# EAGLE design midi_to_cv (EAGLE 7.1.0)
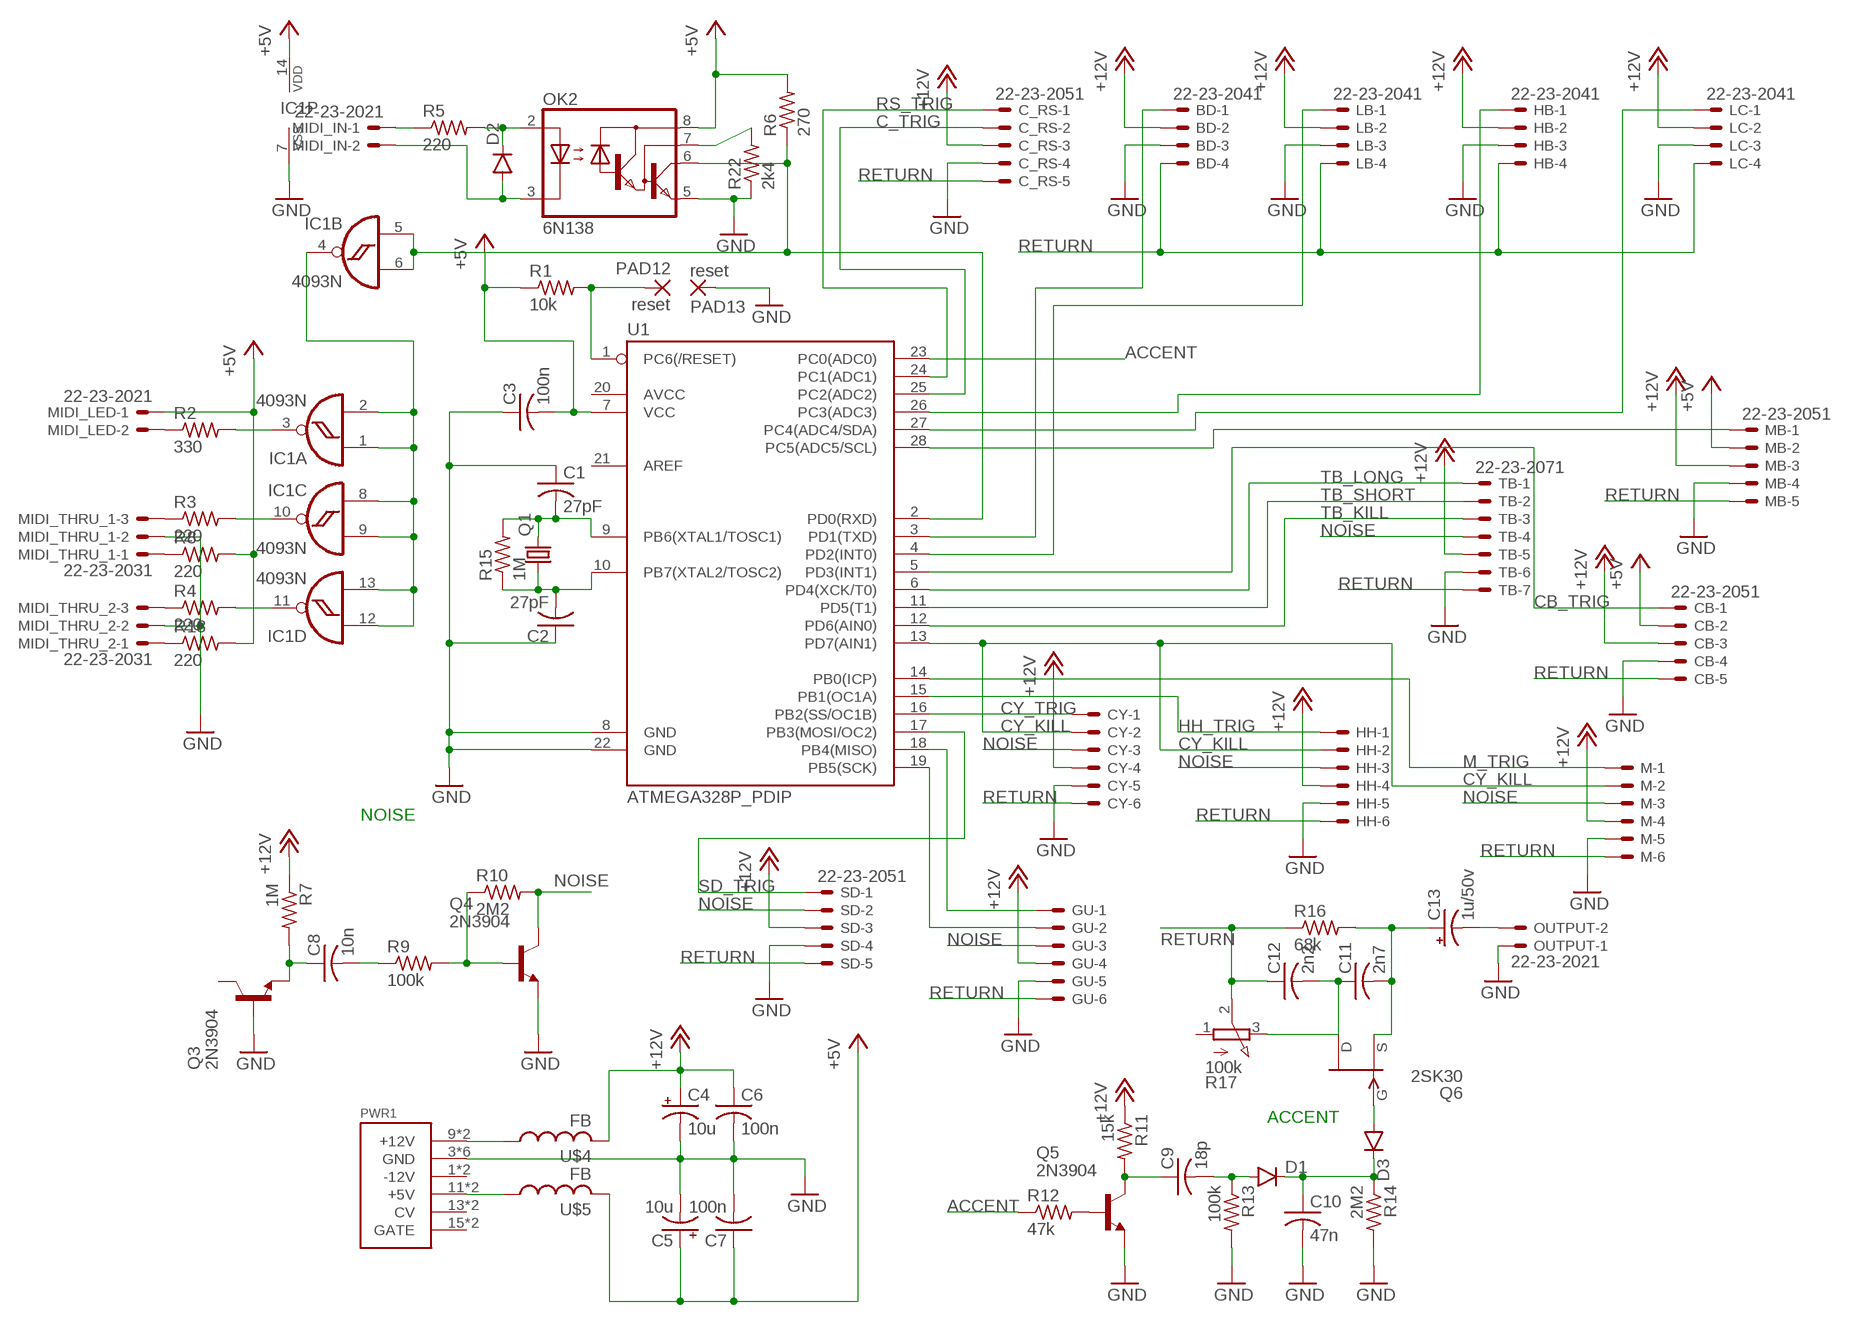
[diagram p0: schematic, sheet 1]

## Parts
BD  22-23-2041  [22-23-2041]
C1  27pF  C-US025-040X050  [C025-040X050]
C2  27pF  C-US025-040X050  [C025-040X050]
C3  100n  C-US025-040X050  [C025-040X050]
C4  10u  CPOL-USB45181A  [B45181A]
C5  10u  CPOL-USB45181A  [B45181A]
C6  100n  C-US050-024X044  [C050-024X044]
C7  100n  C-US050-024X044  [C050-024X044]
C8  10n  C-US025-040X050  [C025-040X050]
C9  18p  C-US050-025X075  [C050-025X075]
C10  47n  C-US025-040X050  [C025-040X050]
C11  2n7  C-US025-040X050  [C025-040X050]
C12  2n2  C-US025-040X050  [C025-040X050]
C13  1u/50v  CPOL-USB45181A  [B45181A]
C_RS  22-23-2051  [22-23-2051]
CB  22-23-2051  [22-23-2051]
CY  22-23-2061  [22-23-2061]
D1  DIODEKIT  [DIODE-1N4148-KIT]
D2  DIODE1N4148  [DIODE-1N4148]
D3  DIODE1N4148  [DIODE-1N4148]
GU  22-23-2061  [22-23-2061]
HB  22-23-2041  [22-23-2041]
HH  22-23-2061  [22-23-2061]
IC1  4093N  [DIL14]
LB  22-23-2041  [22-23-2041]
LC  22-23-2041  [22-23-2041]
M  22-23-2061  [22-23-2061]
MB  22-23-2051  [22-23-2051]
MIDI_IN  22-23-2021  [22-23-2021]
MIDI_LED  22-23-2021  [22-23-2021]
MIDI_THRU_1  22-23-2031  [22-23-2031]
MIDI_THRU_2  22-23-2031  [22-23-2031]
OK2  6N138  [DIL08]
OUTPUT  22-23-2021  [22-23-2021]
PAD12  reset  2,54/0,9  [2,54/0,9]
PAD13  reset  2,54/0,9  [2,54/0,9]
PWR1  POWER  [POWER_16]
Q1  CRYSTALHC49U-V  [HC49U-V]
Q3  2N3904  [TO92]
Q4  2N3904  [TO92]
Q5  2N3904  [TO92]
Q6  2SK30  [TO92]
R1  10k  R-US_0204/7  [0204/7]
R2  330  R-US_0204/7  [0204/7]
R3  220  R-US_0204/7  [0204/7]
R4  220  R-US_0204/7  [0204/7]
R5  220  R-US_0204/7  [0204/7]
R6  270  R-US_0204/7  [0204/7]
R7  1M  R-US_0204/7  [0204/7]
R8  220  R-US_0204/7  [0204/7]
R9  100k  R-US_0204/7  [0204/7]
R10  2M2  R-US_0204/7  [0204/7]
R11  15k  R-US_0204/7  [0204/7]
R12  47k  R-US_0207/12  [0207/12]
R13  100k  R-US_0204/7  [0204/7]
R14  2M2  R-US_0204/7  [0204/7]
R15  1M  R-US_0204/7  [0204/7]
R16  68k  R-US_0204/7  [0204/7]
R17  100k  3RP/1610N  [3RP/1610N]
R18  220  R-US_0204/7  [0204/7]
R22  2k4  R-US_0204/7  [0204/7]
SD  22-23-2051  [22-23-2051]
TB  22-23-2071  [22-23-2071]
U1  ATMEGA328P_PDIP  [DIL28-3]
U$4  FB  [FB]
U$5  FB  [FB]

## Nets
+5V: C3.2 C5.+ C7.1 CB.2 IC1.14(P:VDD) MB.2 MIDI_LED.1 OK2.8(VCC) R1.1 R6.2 R8.2 R18.2 U1.7(VCC) U$5.P$2
+12V: BD.2 C4.+ C6.1 C_RS.3 CB.3 CY.4 GU.4 HB.2 HH.4 LB.2 LC.2 M.4 MB.3 R7.1 R11.1 SD.3 TB.5 U$4.P$2
ACCENT: R12.1 U1.23(PC0(ADC0))
C_TRIG [GND]: C_RS.2 U1.25(PC2(ADC2))
CB_TRIG: CB.1 U1.5(PD3(INT1))
CY_KILL: CY.2 HH.2 M.2 U1.13(PD7(AIN1))
CY_TRIG: CY.1 U1.16(PB2(SS/OC1B))
GND: BD.3 C1.1 C2.1 C3.1 C4.- C5.- C6.2 C7.2 C10.2 C_RS.4 CB.4 CY.5 GU.5 HB.3 HH.5 IC1.7(P:VSS) LB.3 LC.3 M.5 MB.4 MIDI_THRU_1.2 MIDI_THRU_2.2 OK2.5(GND) OUTPUT.1 PAD13.1(P) PWR1.3(GND) PWR1.4(GND) PWR1.5(GND) PWR1.6(GND) PWR1.7(GND) PWR1.8(GND) Q3.2(B) Q4.3(E) Q5.3(E) R13.2 R14.2 R22.1 SD.4 TB.6 U1.8(GND) U1.22(GND)
HH_TRIG: HH.1 U1.15(PB1(OC1A))
M_TRIG: M.1 U1.14(PB0(ICP))
N$1: PAD12.1(P) R1.2 U1.1(PC6(/RESET))
N$2: PWR1.9(+12V) PWR1.10(+12V) U$4.P$1
N$3: BD.1 U1.3(PD1(TXD))
N$4: C1.2 Q1.2 R15.2 U1.9(PB6(XTAL1/TOSC1))
N$5: C2.2 Q1.1 R15.1 U1.10(PB7(XTAL2/TOSC2))
N$6: C8.1 Q3.3(E) R7.2
N$7: LB.1 U1.4(PD2(INT0))
N$8: C8.2 R9.1
N$9: GU.1 U1.18(PB4(MISO))
N$10: GU.2 U1.19(PB5(SCK))
N$11: IC1.5(B:I0) IC1.6(B:I1) OK2.6(VO) R6.1 U1.2(PD0(RXD))
N$12: IC1.3(A:O) R2.2
N$13: Q4.2(B) R9.2 R10.1
N$14: HB.1 U1.26(PC3(ADC3))
N$15: C9.1 Q5.1(C) R11.2
N$16: Q5.2(B) R12.2
N$17: D2.A MIDI_IN.2 OK2.3(C)
N$18: D2.C OK2.2(A) R5.2
N$19: MIDI_IN.1 R5.1
N$20: MIDI_THRU_1.1 R8.1
N$21: C9.2 D1.A R13.1
N$22: C10.1 D1.C D3.C R14.1
N$23: D3.A Q6.2(G)
N$24: MB.1 U1.28(PC5(ADC5/SCL))
N$25: LC.1 U1.27(PC4(ADC4/SDA))
N$26: C13.- OUTPUT.2
N$27: IC1.10(C:O) R3.2
N$28: IC1.11(D:O) R4.2
N$29: C11.1 C12.2 Q6.1(D) R17.3(E)
N$30: IC1.1(A:I0) IC1.2(A:I1) IC1.4(B:O) IC1.8(C:I0) IC1.9(C:I1) IC1.12(D:I0) IC1.13(D:I1)
N$31: MIDI_LED.2 R2.1
N$32: C11.2 C13.+ Q6.3(S) R16.2
N$33: MIDI_THRU_1.3 R3.1
N$34: MIDI_THRU_2.3 R4.1
N$35: MIDI_THRU_2.1 R18.1
N$60: OK2.7(VB) R22.2
N$62: PWR1.11(+5V) PWR1.12(+5V) U$5.P$1
NOISE [GND]: CY.3 GU.3 HH.3 M.3 Q4.1(C) R10.2 SD.2 TB.4
RETURN: BD.4 C12.1 C_RS.5 CB.5 CY.6 GU.6 HB.4 HH.6 LB.4 LC.4 M.6 MB.5 R16.1 R17.2(S) SD.5 TB.7
RS_TRIG: C_RS.1 U1.24(PC1(ADC1))
SD_TRIG: SD.1 U1.17(PB3(MOSI/OC2))
TB_KILL: TB.3 U1.12(PD6(AIN0))
TB_LONG: TB.1 U1.6(PD4(XCK/T0))
TB_SHORT: TB.2 U1.11(PD5(T1))
Unconnected: PWR1.1(-12V) PWR1.2(-12V) PWR1.13(CV) PWR1.14(CV) PWR1.15(GATE) PWR1.16(GATE) Q3.1(C) R17.1(A) U1.20(AVCC) U1.21(AREF)

## Notes on the sheet
- NOISE
- ACCENT

## Library data of the parts
BD HB LB LC = con-molex:22-23-2041: .100" (2.54mm) Center Header - 4 Pin; MF: MOLEX; MPN: 22-23-2041; OC_FARNELL: 1462920; OC_NEWARK: 38C0355
C1-C3 C6-C12 = rcl:C-US: CAPACITOR, American symbol
C4 C5 C13 = rcl:CPOL-US: POLARIZED CAPACITOR, American symbol
C_RS CB MB SD = con-molex:22-23-2051: .100" (2.54mm) Center Header - 5 Pin; MF: MOLEX; MPN: 22-23-2051; OC_FARNELL: 1462952; OC_NEWARK: 38C9178
CY GU HH M = con-molex:22-23-2061: .100" (2.54mm) Center Header - 6 Pin; MF: MOLEX; MPN: 22-23-2061; OC_FARNELL: 1462922; OC_NEWARK: 27C1933
D1-D3 = SparkFun-DiscreteSemi:DIODE: Diode These are standard reverse protection diodes and small signal diodes. SMA package can handle up to about 1A. SOD-323 can handle about 200mA. What the SOD-323 package when ordering, there are some mfgs out there that are 5-pin packages.
IC1 = 40xx:4093: Quad 2-input NAND schmitt trigger
MIDI_IN MIDI_LED OUTPUT = con-molex:22-23-2021: .100" (2.54mm) Center Header - 2 Pin; MF: MOLEX; MPN: 22-23-2021; OC_FARNELL: 1462926; OC_NEWARK: 25C3832
MIDI_THRU_1 MIDI_THRU_2 = con-molex:22-23-2031: .100" (2.54mm) Center Header - 3 Pin; MF: MOLEX; MPN: 22-23-2031; OC_FARNELL: 1462950; OC_NEWARK: 30C0862
OK2 = optocoupler:6N138: MOTOROLA OPTO COUPLER; MF: VISHAY/TELEFUNKEN; MPN: 6N138; OC_FARNELL: 9860150; OC_NEWARK: 35K5294
PAD12 PAD13 = wirepad:2,54/0,9: THROUGH-HOLE PAD
PWR1 = eurorack:POWER
Q1 = crystal:CRYSTAL: CRYSTAL; OC_FARNELL: 1666969; OC_NEWARK: unknown
Q3-Q5 = 808_lt:2N3904: NPN Transistor
Q6 = 808:2SK30
R1-R16 R18 R22 = rcl:R-US_: RESISTOR, American symbol
R17 = pot:3RP/1610N: 16mm Potentiometer one level Source: http://www.alphapotentiometers.net/html/16mm_pot_2.html
TB = con-molex:22-23-2071: .100" (2.54mm) Center Header - 7 Pin; MF: MOLEX; MPN: 22-23-2071; OC_FARNELL: 1654534; OC_NEWARK: 56H0445
U1 = SparkFun-DigitalIC:ATMEGA328P_PDIP: uC used in the Arduino 32kb flash, 1k EEPROM, 2k SRAM This is the through-hole version of this chip.
U$4 U$5 = adafruit:FB: Ferrite bead Digikey #P9821BK-ND

## Net classes
0 default: width 0.635 mm, drill 0.254 mm, clearance 0.254 mm
1 GND: width 1.016 mm, drill 1.016 mm, clearance 0.508 mm

## Board
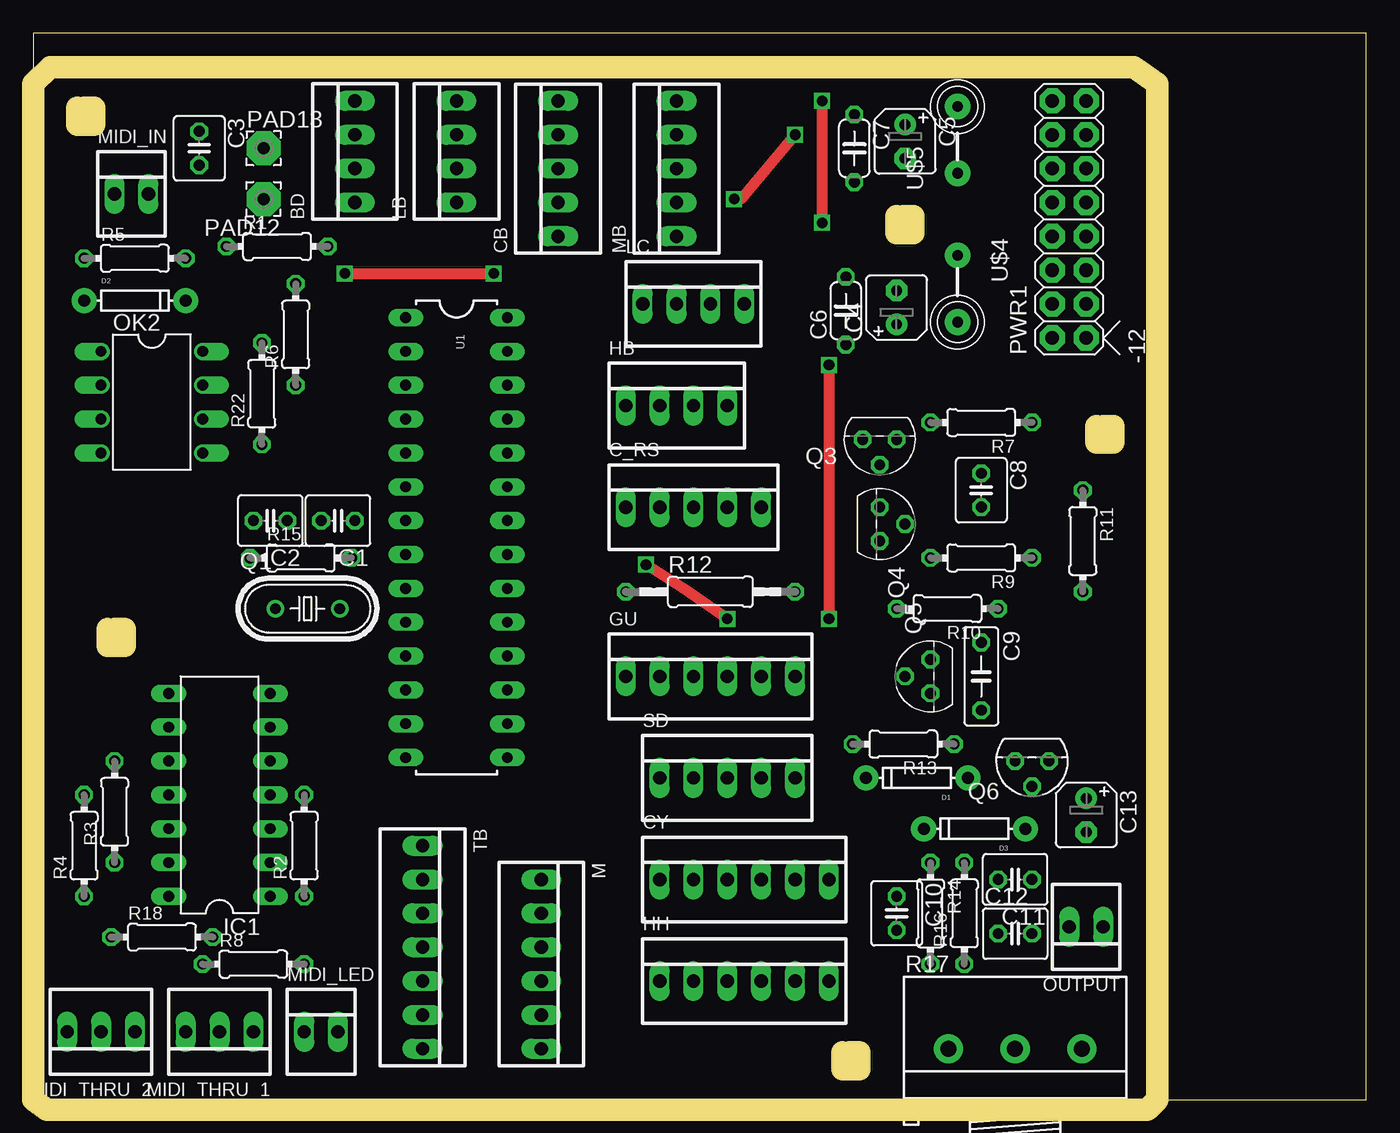
[diagram p1: board, top side]
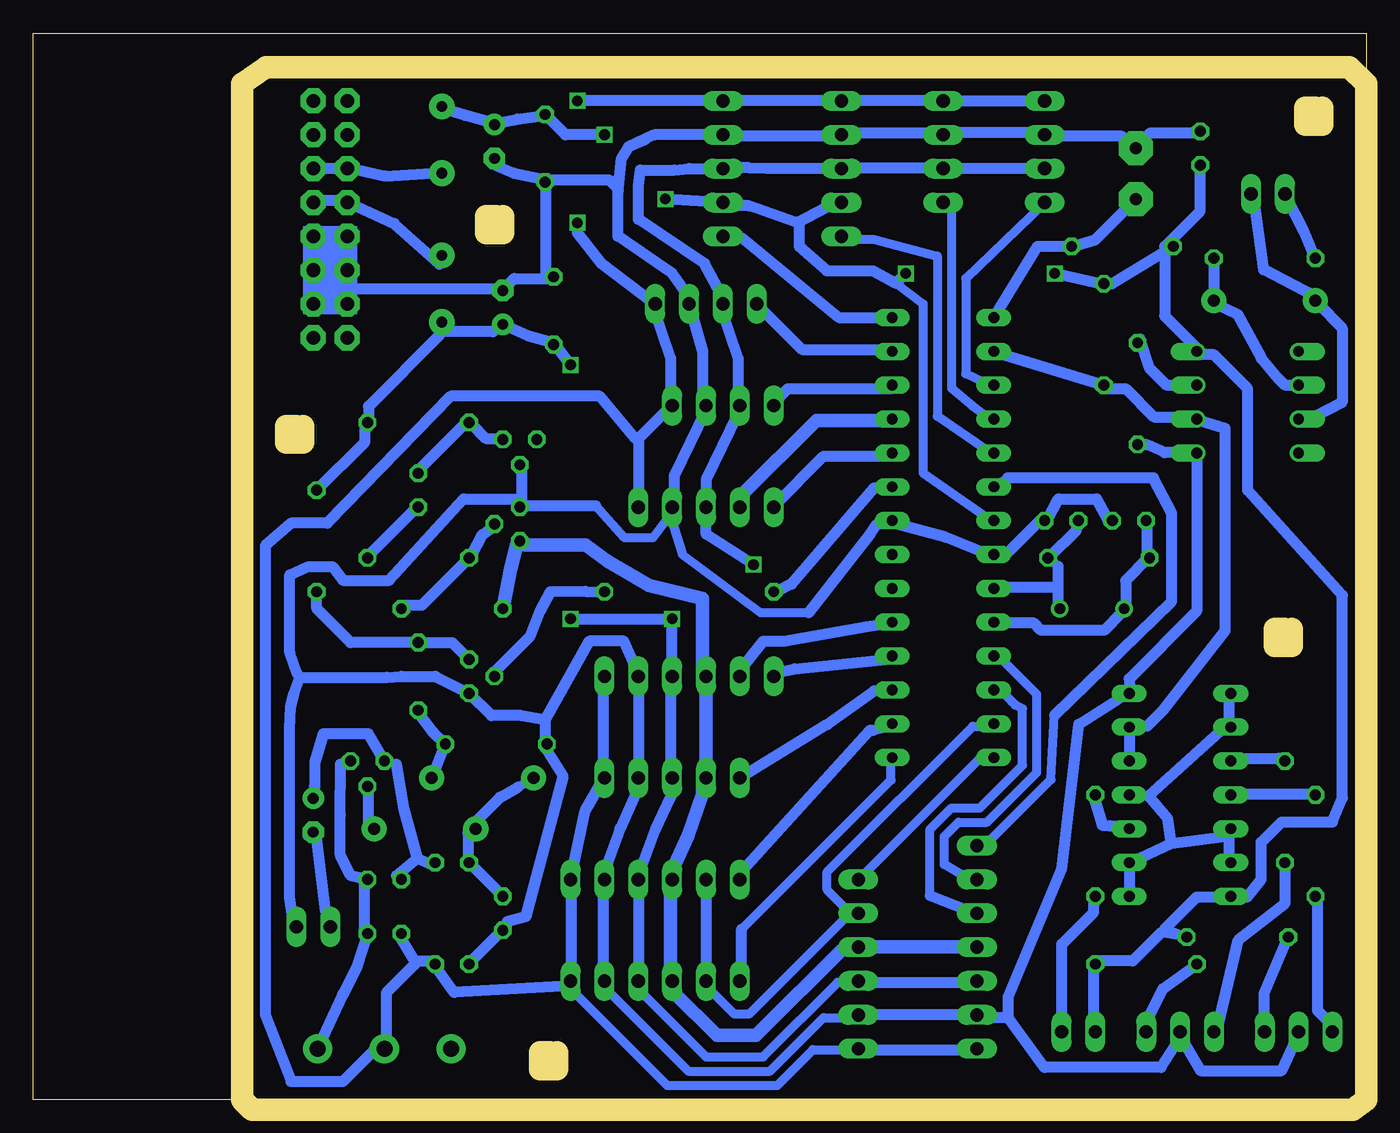
[diagram p2: board, bottom side, seen from below]

Size 100 x 80 mm. Coordinates in mm from the lower left corner, seen from the top.
Outline: 0,0 100,0 100,80 0,80 0,0
Copper layers (1*16): Top 0.035mm / dielectric 1.5mm / Bottom 0.035mm
Design rules "default *": minimum track width 26mil, minimum drill 31mil, track to track 16mil, track to pad 16mil, pad to pad 16mil, via to via 16mil, smd to smd 8mil, copper to edge 0mil, drill to drill 16mil, minimum pad ring 10mil, minimum via ring 8mil, stop-mask expansion 4mil, vias tented up to drill 0mil, thermal gap 10mil
Milling: 28 lines

### Footprints (pad centres in the part's own frame; a part is rotated, then mirrored left to right if it is on the bottom)
22-23-2041 = drill 1 long: 1 -3.81,0; 2 -1.27,0; 3 1.27,0; 4 3.81,0
C025-040X050 = drill 0.813 octagon: 1 -1.27,0; 2 1.27,0
B45181A = drill 0.813 pad 1.6: + -1.27,0 | drill 0.813 pad 1.6 octagon: - 1.27,0
C050-024X044 = drill 0.813 octagon: 1 -2.54,0; 2 2.54,0
C050-025X075 = drill 0.813 octagon: 1 -2.54,0; 2 2.54,0
22-23-2051 = drill 1 long: 1 -5.08,0; 2 -2.54,0; 3 0,0; 4 2.54,0; 5 5.08,0
22-23-2061 = drill 1 long: 1 -6.35,0; 2 -3.81,0; 3 -1.27,0; 4 1.27,0; 5 3.81,0; 6 6.35,0
DIODE-1N4148-KIT = drill 0.9 pad 1.88: A -3.81,0; C 3.81,0
DIODE-1N4148 = drill 0.9 pad 1.88: A -3.81,0; C 3.81,0
DIL14 = drill 0.813 long: 1 -7.62,-3.81; 2 -5.08,-3.81; 3 -2.54,-3.81; 4 0,-3.81; 5 2.54,-3.81; 6 5.08,-3.81; 7 7.62,-3.81; 8 7.62,3.81; 9 5.08,3.81; 10 2.54,3.81; 11 0,3.81; 12 -2.54,3.81; 13 -5.08,3.81; 14 -7.62,3.81
22-23-2021 = drill 1 long: 1 -1.27,0; 2 1.27,0
22-23-2031 = drill 1 long: 1 -2.54,0; 2 0,0; 3 2.54,0
DIL08 = drill 0.813 offset: 1 -3.81,-3.81; 2 -1.27,-3.81; 3 1.27,-3.81; 4 3.81,-3.81; 5 3.81,3.81; 6 1.27,3.81; 7 -1.27,3.81; 8 -3.81,3.81
2,54/0,9 = drill 0.914 pad 2.54 octagon: 1 0,0
POWER_16 = drill 1.016 pad 1.88 octagon: 1 -6.35,-1.27; 2 -6.35,1.27; 3 -3.81,-1.27; 4 -3.81,1.27; 5 -1.27,-1.27; 6 -1.27,1.27; 7 1.27,-1.27; 8 1.27,1.27; 9 3.81,-1.27; 10 3.81,1.27; 11 6.35,-1.27; 12 6.35,1.27; 13 8.89,-1.27; 14 8.89,1.27; 15 11.43,-1.27; 16 11.43,1.27
HC49U-V = drill 0.813: 1 -2.413,0; 2 2.413,0
TO92 = drill 0.813 octagon: 1 1.27,0; 2 0,1.905; 3 -1.27,0
TO92' = drill 0.813 octagon: 1 -1.27,0; 2 0,1.905; 3 1.27,0
0204/7 = drill 0.813 octagon: 1 -3.81,0; 2 3.81,0
0207/12 = drill 0.813 octagon: 1 -6.35,0; 2 6.35,0
3RP/1610N = drill 1.2 pad 2.184: 1 -5,0; 2 0,0; 3 5,0
22-23-2071 = drill 1 long: 1 -7.62,0; 2 -5.08,0; 3 -2.54,0; 4 0,0; 5 2.54,0; 6 5.08,0; 7 7.62,0
DIL28-3 = drill 0.813 long: 1 -16.51,-3.81; 2 -13.97,-3.81; 3 -11.43,-3.81; 4 -8.89,-3.81; 5 -6.35,-3.81; 6 -3.81,-3.81; 7 -1.27,-3.81; 8 1.27,-3.81; 9 3.81,-3.81; 10 6.35,-3.81; 11 8.89,-3.81; 12 11.43,-3.81; 13 13.97,-3.81; 14 16.51,-3.81; 15 16.51,3.81; 16 13.97,3.81; 17 11.43,3.81; 18 8.89,3.81; 19 6.35,3.81; 20 3.81,3.81; 21 1.27,3.81; 22 -1.27,3.81; 23 -3.81,3.81; 24 -6.35,3.81; 25 -8.89,3.81; 26 -11.43,3.81; 27 -13.97,3.81; 28 -16.51,3.81
FB = drill 0.8 pad 1.93: P$1 -2.5,0; P$2 2.5,0

### Placement (x,y rotation side)
BD  24.13,71.12 90 top
C1  22.86,43.43 180 top
C2  17.78,43.43 180 top
C3  12.45,71.37 270 top
C4  64.77,59.44 90 top
C5  65.41,71.88 270 top
C6  60.96,59.18 90 top
C7  61.59,71.37 270 top
C8  71.12,45.72 270 top
C9  71.12,31.75 270 top
C10  64.77,13.97 270 top
C11  73.66,16.51 180 top
C12  73.66,12.45 0 top
C13  78.99,21.34 270 top
C_RS  49.53,44.45 0 top
CB  39.37,69.85 90 top
CY  53.34,16.51 0 top
D1  66.29,24.13 180 top
D2  7.62,59.94 0 top
D3  70.61,20.32 180 top
GU  50.8,31.75 0 top
HB  48.26,52.07 0 top
HH  53.34,8.89 0 top
IC1  13.97,22.86 90 top
LB  31.75,71.12 90 top
LC  49.53,59.69 0 top
M  38.1,10.16 270 top
MB  48.26,69.85 90 top
MIDI_IN  7.37,67.94 0 top
MIDI_LED  21.59,5.08 0 top
MIDI_THRU_1  13.97,5.08 180 top
MIDI_THRU_2  5.08,5.08 180 top
OK2  8.89,52.32 270 top
OUTPUT  78.99,12.95 180 top
PAD12  17.27,67.56 180 top
PAD13  17.27,71.37 0 top
PWR1  77.72,63.5 90 top
Q1  20.57,36.83 0 top
Q3  63.5,49.53 180 top
Q4  63.5,43.18 270 top
Q5  67.31,31.75 90 top
Q6  2SK30  [TO92']  74.93,25.4 180 top
R1  18.29,64.01 0 top
R2  20.32,19.05 90 top
R3  6.1,21.59 90 top
R4  3.81,19.05 90 top
R5  7.62,63.12 0 top
R6  19.68,57.4 90 top
R7  71.12,50.8 180 top
R8  16.51,10.16 0 top
R9  71.12,40.64 180 top
R10  68.58,36.83 180 top
R11  78.74,41.91 270 top
R12  50.8,38.1 0 top
R13  65.28,26.67 180 top
R14  67.31,13.97 270 top
R15  20.07,40.64 0 top
R16  69.85,13.97 90 top
R17  73.66,3.81 0 top
R18  9.65,12.19 0 top
R22  17.14,52.96 90 top
SD  52.07,24.13 0 top
TB  29.21,11.43 270 top
U1  31.75,42.16 270 top
U$4  69.34,60.83 270 top
U$5  69.34,72.01 90 top

### Tracks (layer width: path | path; a pad name or v marks a point on that pad's centre or on a via)
+5V  (via drill 0.8)
  Top 0.813: v23.37,61.98 v34.54,61.98 | v52.58,67.56 53.09,67.56 v57.15,72.39
  Bottom 0.66: 12.71,56.39 12.71,56.27 OK2.8 | 15.11,63.74 R1.1 15.11,64.01 | 20.45,10.13 R8.2 20.18,10.4 | 20.45,5.33 MIDI_LED.1 | 12.71,15.2 10.31,15.2 IC1.14 | 15.11,12.8 R18.2 15.38,12.54 | 35.28,61.24 33.25,59.72 33.25,47.02 28.18,43.47 U1.7 | 39.92,67.21 39.38,67.21 CB.2 | 42.81,65.85 42.55,65.85 | 61.78,73.81 C7.1 | 65.25,73.25 C5.+ 65.52,73.25 | 69.25,74.35 U$5.P$2
  Bottom 0.813: 12.71,56.39 15.11,58.79 15.11,63.74 | C3.2 12.45,66.67 15.11,64.01 | 20.45,5.33 20.45,10.13 | 15.11,12.8 12.71,15.2 8.93,15.2 7.87,16.51 7.87,19.3 6.35,20.83 2.54,20.83 1.78,22.61 1.78,37.85 8.89,45.72 8.89,53.34 11.43,55.88 12.45,55.88 OK2.8 | 20.18,10.4 17.51,10.4 15.38,12.54 | 39.92,67.21 42.55,65.85 42.55,64.02 40.46,62.19 36.99,62.19 35.28,61.24 v34.54,61.98 | 42.81,65.85 46.32,67.07 48.02,67.07 MB.2 v52.58,67.56 | 61.78,73.81 63.68,73.56 65.25,73.25 | 69.25,74.35 67.63,73.84 65.52,73.25 | R1.1 19.05,61.21 R6.2 20.07,61.21 v23.37,61.98 | v57.15,72.39 60.07,72.39 C7.1
+12V  (via drill 0.8)
  Top 0.813: v52.07,36.07 48.77,38.35 v45.97,40.13 | v59.69,55.12 v59.69,36.07
  Bottom 0.66: 75.12,50.67 R7.1 74.85,50.94 | 60.98,56.81 C6.1 | 64.72,58.14 C4.+ 64.99,58.14 | 69.25,57.61 U$4.P$2 | 24.18,69.88 BD.2 | 31.65,69.88 LB.2 31.91,69.88 | 39.12,69.88 CB.3 39.65,69.88 | 47.12,52.27 HB.2 47.12,52.01 47.12,51.47 | 48.45,59.47 LC.2 48.18,60.01 | 49.52,44.54 C_RS.3 | 29.25,8.8 TB.5 | 38.05,8.8 M.4 38.32,8.8 39.65,8.8 45.25,3.2 49.52,3.2 54.32,8 54.32,8.8 HH.4 54.59,9.07 | 52.18,24.27 SD.3 52.18,24 52.18,22.67 | 52.18,31.74 GU.4 | 54.59,16.27 CY.4 54.59,16.8
  Bottom 0.813: 75.12,50.67 75.12,49.34 R11.1 | 64.72,58.14 62.88,57.31 60.98,56.81 v59.69,55.12 | 69.25,57.61 65.52,57.61 64.99,58.14 | 74.85,50.94 74.85,52.01 69.52,57.34 U$4.P$2 | 31.65,69.88 24.18,69.88 | 31.91,69.88 39.12,69.88 | 47.12,52.27 47.12,55.6 48.45,59.47 | 49.52,44.54 49.52,46.53 47.12,51.47 | 48.18,60.01 49.63,62.73 54.61,66.04 54.61,68.58 54.46,69.75 51.92,69.75 50.8,69.85 MB.3 48.2,69.91 46.29,69.91 44.98,69.88 39.65,69.88 | 38.05,8.8 29.25,8.8 | 52.18,31.74 52.18,24.27 | 54.59,16.27 54.59,9.07 | 52.18,22.67 53.31,20.27 54.59,16.8 | GU.4 v52.07,36.07 v59.69,36.07 | v45.97,40.13 49.53,42.42 C_RS.3
ACCENT
  Bottom 0.66: 44.13,38.14 R12.1 | 36.92,45.88 U1.23
  Bottom 0.813: 44.13,38.14 43.12,38.67 36.92,45.88
C_TRIG
  Bottom 1.016: U1.25 35.65,50.94 41.25,50.94 46.85,45.34 46.85,44.54 C_RS.2
CB_TRIG
  Bottom 0.66: U1.5 28.18,48.54 32.18,51.27 32.18,63.3 36.98,64.54 39.12,64.54 CB.1
CY_KILL
  Bottom 0.66: 49.52,9.07 HH.2 49.25,8.8 49.25,8.27 47.38,6.4 46.32,6.4 38.85,13.87 M.2 38.32,14.13 38.85,14.13 40.45,15.73 40.45,17.07 29.52,28 28.18,28 U1.13 | 49.52,16.27 CY.2
  Bottom 0.813: 49.52,16.27 49.52,9.07
CY_TRIG
  Bottom 0.66: 36.96,27.71 35.65,28 U1.16 | 46.85,17.07 46.85,16.54 CY.1
  Bottom 0.813: 36.96,27.71 37.22,27.71 46.85,17.07
GND
  Bottom 0.66: 79.12,62.41 PWR1.5 78.85,62.41 | 79.12,64.54 PWR1.7 | 76.45,60.81 PWR1.6 76.72,62.41 | 78.85,59.74 PWR1.3 | 76.72,59.74 PWR1.4 | 60.98,61.61 C6.2 | 64.72,60.81 C4.- 64.99,60.81 | 61.57,69.01 61.78,69.01 C7.2 61.52,69.01 | 65.25,70.08 C5.- | 12.71,48.27 OK2.5 12.98,48.54 | 31.91,72.54 LB.3 31.65,72.54 | 39.12,72.54 CB.4 39.65,72.28 | 12.45,72.54 C3.1 | 17.25,71.48 PAD13.1 17.51,71.48 18.31,72.28 | 23.91,72.28 BD.3 24.18,72.54 | 19.39,43.47 19.11,43.47 C2.1 | 23.91,43.47 C1.1 24.45,43.47 | 26.85,41.07 27.91,41.07 U1.8 28.18,40.8 | 35.38,43.2 U1.22 35.65,43.2 | 63.39,44.54 Q4.3 | 63.39,47.47 Q3.2 | 49.78,52.27 HB.3 49.52,51.74 | 51.92,44.54 C_RS.4 | 50.85,60.27 50.85,60.01 LC.3 | 57.78,44.54 55.64,42.14 53.54,42.14 51.92,44.27 C_RS.4 | 63.12,44.54 Q4.3 | 41.82,36.54 45.43,36.54 51.31,40.89 52.18,43.74 C_RS.4 | 29.25,6.4 TB.6 28.98,6.13 | 38.05,6.4 M.5 38.32,6.13 40.72,6.13 44.72,2.13 50.85,2.13 56.98,8.27 56.98,8.8 HH.5 57.25,9.07 | 5.25,4.53 5.25,5.07 MIDI_THRU_2.2 | 13.78,4.53 13.78,5.07 MIDI_THRU_1.2 14.05,4.53 | 80.5,13.37 OUTPUT.1 | 57.25,16.27 CY.5 57.25,16.8 | 64.99,12.54 C10.2 64.45,12.8 64.45,13.34 | 67.12,10.4 R14.2 | 54.85,32.54 54.85,32 GU.5 54.59,31.47 | 61.61,26.67 R13.2 61.61,26.4 | 54.59,24.27 SD.4 54.32,24 | 63.65,45.06 Q4.3 | 80.19,31.94 80.01,31.68 | 18.05,30.4 IC1.7
  Bottom 0.813: 79.12,64.54 79.12,62.41 | PWR1.4 76.45,60.81 64.99,60.81 | PWR1.6 PWR1.8 | 76.72,59.74 78.85,59.74 | 76.72,62.41 78.85,62.41 | 61.57,61.61 63.92,61.61 64.72,60.81 | 61.57,61.61 60.98,61.61 | 65.25,70.08 63.93,69.52 61.57,69.01 61.57,61.61 | IC1.7 17.78,31.57 12.71,36.64 12.71,48.27 | 12.98,48.54 15.11,48.54 16.47,49.14 R22.1 | 39.12,72.54 31.91,72.54 | 12.45,72.54 16.18,72.54 17.25,71.48 | 18.31,72.28 23.91,72.28 | 24.18,72.54 31.65,72.54 | 19.39,43.47 20.23,45.07 23.08,45.07 23.91,43.47 | 24.45,43.47 26.85,41.07 | 35.38,43.2 31.6,42.19 28.18,40.8 | 63.39,47.47 63.39,44.54 | 49.78,52.27 49.78,56.13 LC.3 | 51.92,44.54 51.92,46.8 49.52,51.74 | 50.85,60.27 52.05,61.98 56.13,64.77 56.13,68.07 | 57.78,44.54 63.12,44.54 | 35.65,43.2 36.7,43.17 37.22,42.41 41.82,36.54 | 38.05,6.4 29.25,6.4 | 5.25,4.53 6.35,2.16 12.42,2.16 13.78,4.53 | 26.85,6.13 28.98,6.13 | 26.85,6.13 24.14,2.41 15.4,2.41 14.05,4.53 | 80.5,13.37 80.77,15.16 80.77,27.84 80.7,29.44 80.44,30.49 80.01,31.68 73.47,31.68 72.39,31.75 69.85,31.75 Q5.3 65.63,28.8 63.39,28.8 61.61,28.54 | 57.25,16.27 57.25,9.07 | 67.12,10.4 64.99,12.54 | 61.61,28.54 61.61,26.67 | 61.61,28.54 58.29,34.39 55.69,34.39 54.85,32.54 | 54.59,31.47 54.59,24.27 | 64.45,13.34 63.06,13.72 60.26,24.3 61.61,26.4 | 57.25,16.8 55.98,20.31 54.32,24 | 63.65,45.06 67.7,45.06 73.3,38.95 76.77,38.95 77.56,39.99 79.38,39.99 80.76,39.37 80.76,33.53 80.19,31.94 | 18.05,30.4 21.57,28.16 22.84,17.32 26.85,7.72 26.85,6.13 | 56.13,68.07 56.13,68.33 56.82,69.01 61.52,69.01 | 56.13,68.07 55.85,70.64 55.35,71.49 | 55.35,71.49 54.1,72.02 | 39.65,72.28 48.15,72.28 MB.4 53.43,72.39 55.35,71.49
HH_TRIG
  Bottom 0.66: 46.85,12.78 35.65,23.98 35.65,25.6 U1.15 | 46.85,9.07 HH.1
  Bottom 0.813: 46.85,9.07 46.85,12.78
M_TRIG
  Bottom 0.66: U1.14 28.18,25.6 28.98,25.6 38.05,16.54 M.1
N$1
  Bottom 0.66: 22.57,63.99 22.23,63.74 R1.2 | 27.91,58.67 U1.1
  Bottom 0.813: 22.57,63.99 24.65,63.99 U1.1 | R1.2 20.32,64.52 PAD12.1
N$2
  Bottom 0.66: 76.45,67.47 PWR1.10 76.19,67.21 | 78.85,67.47 PWR1.9 | 69.52,62.67 U$4.P$1
  Bottom 0.813: 78.85,67.47 76.45,67.47 | 69.52,62.67 72.92,65.72 76.19,67.21
N$3
  Bottom 0.66: U1.3 28.18,53.61 30.05,54.46 30.05,61.59 24.18,67.21 BD.1
N$4
  Bottom 0.66: 23.11,40.01 23.65,40.54 R15.2 23.65,40.8 | 23.11,37.07 Q1.2 | 21.78,42.67 21.78,43.2 C1.2 | 27.91,38.41 U1.9
  Bottom 0.813: 23.11,40.01 23.11,38.41 | 23.11,38.41 23.11,37.07 | 23.65,40.8 21.78,42.67 | 23.11,38.41 27.91,38.41
N$5
  Bottom 0.66: 16.45,40.8 R15.1 16.45,40.54 | 16.45,43.2 C2.2 | 18.05,37.07 Q1.1 18.31,36.54 | 27.91,35.74 U1.10
  Bottom 0.813: 16.45,43.2 16.45,40.8 | 18.05,37.07 18.05,38.94 16.45,40.54 | 27.91,35.74 24.93,35.74 24.4,35.2 19.65,35.2 18.31,36.54
N$6
  Bottom 0.66: 71.12,47.21 C8.1 | 67.39,50.94 R7.2 67.12,50.67 | 64.99,49.61 Q3.3
  Bottom 0.813: 67.39,50.94 71.12,47.21 | 64.99,49.61 66.05,49.61 67.12,50.67
N$7
  Bottom 0.66: LB.1 31.11,66.67 31.11,53.37 29.52,52.02 28.49,51.26 28.18,51.21 U1.4
N$8
  Bottom 0.66: 74.85,40.8 R9.1 | 71.12,44.54 C8.2
  Bottom 0.813: 71.12,44.54 74.85,40.8
N$9
  Bottom 0.66: 35.65,33.07 U1.18 | 44.45,32 GU.1
  Bottom 0.813: 35.65,33.07 42.88,32.31 44.45,32
N$10
  Bottom 0.66: 35.65,35.74 U1.19 | 47.12,32 GU.2
  Bottom 0.813: 35.65,35.74 37.47,35.48 43.64,34.39 45.24,34.39 47.12,32
N$11
  Bottom 0.66: 12.71,51.21 OK2.6 12.45,50.94 | 19.65,53.34 R6.1 | 17.51,28 IC1.6
  Bottom 0.813: IC1.6 IC1.5 | 12.71,51.21 15.91,51.21 18.05,53.34 19.65,53.34 | 17.51,28 16.45,28 15.24,29.21 10.6,35.17 10.6,50.37 12.45,50.94 | U1.2 R6.1
N$12
  Bottom 0.66: 18.31,20.54 17.78,20.54 IC1.3 | 20.45,22.67 R2.2
  Bottom 0.813: 20.45,22.67 19.81,20.57 19.27,20.54 18.31,20.54
N$13
  Bottom 0.66: 72.19,37.07 R10.1 | 67.39,40.54 R9.2 67.12,40.8 | 65.52,42.94 Q4.2
  Bottom 0.813: 72.19,37.07 70.85,37.07 67.39,40.54 | 65.52,42.94 66.28,42.41 67.12,40.8
N$14
  Bottom 0.66: 35.65,53.34 U1.26 | 44.45,52.27 HB.1
  Bottom 0.813: 35.65,53.34 43.38,53.34 44.45,52.27
N$15
  Bottom 0.813: R11.2 78.74,36.83 76.2,34.29 C9.1 68.58,34.29 Q5.1
N$16
  Bottom 0.813: R12.2 58.59,38.12 61.21,38.1 62.01,36.61 62.78,34.7 65.41,32.07 Q5.2
N$17
  Bottom 0.66: 3.91,51.21 4.98,51.21 OK2.3 | 3.65,59.74 D2.A 3.91,60.27 | 8.45,67.74 MIDI_IN.2
  Bottom 0.813: 3.91,51.21 1.8,52.3 1.8,57.9 3.65,59.74 | 8.45,67.74 7.68,62.27 3.91,60.27
N$18
  Bottom 0.66: 5.25,53.61 OK2.2 | 11.38,59.74 D2.C 11.38,60.27 | 11.38,62.94 R5.2
  Bottom 0.813: 11.38,59.74 9.65,58.93 7.87,55.63 6.6,54.1 6.11,53.61 5.25,53.61 | 11.38,60.27 11.38,62.94
N$19
  Bottom 0.66: 3.91,63.21 R5.1 | 6.04,67.74 MIDI_IN.1
  Bottom 0.813: 3.91,63.21 4.67,65.1 6.04,67.74
N$20
  Bottom 0.66: 12.71,10.13 R8.1 | 16.71,5.33 MIDI_THRU_1.1
  Bottom 0.813: 12.71,10.13 15.25,8.32 16.71,5.33
N$21
  Bottom 0.66: 71.26,29.2 C9.2
  Bottom 0.813: 71.26,29.2 69.99,27.55 R13.1 D1.A
N$22
  Bottom 0.66: 64.99,15.47 C10.1 | 67.12,17.6 R14.1 67.39,17.87 | 63.65,23.43 D1.C | 67.12,20.54 D3.C 67.39,20
  Bottom 0.813: 67.12,17.6 64.99,15.47 | 63.65,23.43 64.99,22.67 67.12,20.54 | 67.39,20 67.39,17.87
N$23
  Bottom 0.66: 74.85,23.47 Q6.2 | 74.85,20.54 D3.A
  Bottom 0.813: 74.85,20.54 74.85,23.47
N$24
  Bottom 0.813: U1.28 39.59,58.67 46.85,64.67 MB.1
N$25
  Bottom 0.66: 35.65,56.27 U1.27 | 45.52,59.47 LC.1
  Bottom 0.813: 35.65,56.27 42.32,56.27 45.52,59.47
N$26
  Bottom 0.66: 79.41,19.81 78.85,20.27 | 78.09,14.13 OUTPUT.2
  Bottom 0.813: 78.85,20.27 78.09,14.13 | 79.41,19.81 C13.-
N$27
  Bottom 0.66: 6.58,25.6 R3.2 | 10.05,25.6 IC1.10
  Bottom 0.813: 10.05,25.6 6.58,25.6
N$28
  Bottom 0.66: 3.91,22.94 R4.2 | 10.05,22.94 IC1.11
  Bottom 0.813: 10.05,22.94 3.91,22.94
N$29
  Bottom 0.66: 75.17,12.8 C12.2 | 75.17,16.27 C11.1 | 76.45,25.34 Q6.1 | 78.59,4 R17.3
  Bottom 0.813: 75.17,16.27 75.17,12.8 | 76.45,25.34 76.96,25.15 76.97,21.32 76.97,18.35 76.19,16.8 C11.1 | 78.59,4 76.81,7.86 75.69,9.99 C12.2
N$30
  Bottom 0.66: 10.31,28 IC1.9 10.58,28 | 10.31,30.4 IC1.8 | 10.31,17.87 IC1.13 | 10.31,20.27 IC1.12 10.58,19.74 | 16.33,22.77 17.25,22.67 17.78,22.67 IC1.4 | 17.51,17.87 IC1.2
  Bottom 0.813: 10.31,30.4 10.31,28 | 10.31,20.27 10.31,17.87 | IC1.2 IC1.1 | 14.63,19.23 14.88,21.07 16.33,22.77 10.58,28 | 17.51,17.87 14.63,19.23 | 14.63,19.23 10.58,19.74
N$31
  Bottom 0.66: 20.45,15.2 R2.1 | 22.85,5.33 MIDI_LED.2
  Bottom 0.813: 20.45,15.2 20.45,14.05 22.85,11.65 22.85,5.33
N$32
  Bottom 0.66: 70.05,17.6 R16.2 | 72.76,25.15 73.52,25.34 Q6.3 73.79,25.6
  Bottom 0.813: 71.18,18.11 70.05,17.6 | 71.18,18.11 72.76,16.79 C11.2 | 72.76,25.15 72.2,21.79 71.18,18.11 | 73.79,25.6 74.87,27.45 78.25,27.45 78.88,25.29 78.91,23.51 C13.+
N$33
  Bottom 0.66: 11.11,5.6 11.38,5.33 MIDI_THRU_1.3 | 6.07,17.6 R3.1
  Bottom 0.813: 6.07,17.6 6.07,14.72 9.59,11.96 11.11,5.6
N$34
  Bottom 0.66: 3.65,15.2 R4.1 | 2.31,5.33 MIDI_THRU_2.3
  Bottom 0.813: 3.65,15.2 3.65,6.67 2.31,5.33
N$35
  Bottom 0.66: 7.64,5.33 MIDI_THRU_2.1
  Bottom 0.813: 7.64,5.33 7.64,7.96 R18.1
N$60
  Bottom 0.66: 16.98,57.07 16.98,56.35 R22.2 | 12.71,53.61 OK2.7
  Bottom 0.813: 16.98,57.07 16.26,54.86 15,53.61 12.71,53.61
N$62
  Bottom 0.66: 76.45,69.88 PWR1.12 76.19,69.88 | 78.85,69.88 PWR1.11 | 69.52,69.55 U$5.P$1
  Bottom 0.813: 78.85,69.88 76.45,69.88 | 69.52,69.55 73.57,69.29 76.19,69.88
NOISE
  Bottom 1.016: TB.4 29.25,11.47 38.05,11.47 M.3 38.58,11.47 39.12,11.47 45.78,4.8 48.72,4.8 51.92,8 51.92,8.53 HH.3 52.18,9.07 52.18,16.27 CY.3 51.91,17.56 50.89,19.8 49.78,22.94 49.78,23.74 SD.2 49.52,24.27 49.52,31.74 GU.3 49.78,32 49.78,37.59 53.8,38.56 54.81,39.17 56.9,40.39 58.59,41.6 63.12,41.6 Q4.1 63.65,41.87 64.21,39.79 64.72,37.07 R10.2
RETURN  (via drill 0.8)
  Top 0.813: v59.18,74.93 v59.18,65.79
  Bottom 0.66: 70.05,10.4 R16.1 69.79,9.87 69.76,9.87 | 72.5,12.28 C12.1 | 73.52,4 R17.2 73.79,3.73 74.4,3.73 | 71.39,10.13 71.39,10.4 | 29.25,3.73 TB.7 | 38.05,3.73 M.6 38.32,3.73 41.52,3.73 44.18,1.07 52.45,1.07 59.38,8 59.38,8.8 HH.6 | 59.65,9.07 HH.6 | 59.65,16.27 CY.6 59.65,16.8 | 57.25,24.27 SD.5 57.25,24 | 57.25,31.74 GU.6 | 59.65,8.53 HH.6 | 24.18,74.94 BD.4 | 31.65,74.94 LB.4 31.91,74.94 | 39.12,74.94 CB.5 39.65,74.94 | 52.18,52.27 HB.4 52.18,52.01 | 53.52,59.47 LC.4 53.25,60.01 | 54.59,44.54 C_RS.5 | 54.85,49.61 54.59,49.61 | 80.66,43.24 80.66,43.26
  Bottom 0.813: 70.05,10.4 71.39,10.4 72.5,12.28 | 73.52,4 73.52,8 71.39,10.13 | 38.05,3.73 29.25,3.73 | 59.65,16.27 59.65,9.07 | 57.25,31.74 57.25,24.27 | 59.65,16.8 58.64,21.6 57.25,24 | 69.76,9.87 68.43,8.03 59.65,8.53 | 31.65,74.94 24.18,74.94 | 31.91,74.94 39.12,74.94 | 52.18,52.27 52.18,55.6 53.52,59.47 | 54.59,44.54 54.59,49.61 52.18,52.01 | 80.66,43.26 77.95,43.26 68.68,52.78 57.52,52.78 54.85,49.61 | 74.4,3.73 76.77,1.36 80.66,1.36 82.6,6.35 82.6,41.55 80.66,43.24 | 39.65,74.94 48.25,74.94 MB.5 v59.18,74.93 | v59.18,65.79 59.18,65.02 57.4,62.74 LC.4
RS_TRIG
  Bottom 0.66: 35.65,48.27 U1.24 | 44.45,44.54 C_RS.1
  Bottom 0.813: 35.65,48.27 40.72,48.27 44.45,44.54
SD_TRIG
  Bottom 0.66: 36.92,30.67 U1.17
  Bottom 0.813: 36.92,30.67 40.45,28.13 SD.1
TB_KILL
  Bottom 0.66: 32.72,15.29 32.72,20.27 31.11,21.87 28.98,21.87 25.78,25.07 25.78,29.31 26.33,29.6 26.59,29.86 27.66,30.92 U1.12 | 29.78,14.13 29.25,14.13 TB.3
  Bottom 0.813: 29.78,14.13 32.72,15.29
TB_LONG
  Bottom 0.66: 23.39,28.83 23.65,24 28.45,19.2 28.98,19.2 TB.1 | 26.9,46.65 U1.6
  Bottom 0.813: 26.9,46.65 15.96,46.65 14.59,44.01 14.59,37.38 23.39,28.83
TB_SHORT
  Bottom 0.66: U1.11 27.91,33.07 27.38,33.07 24.71,30.4 24.71,24.54 28.45,20.8 30.58,20.8 31.65,19.74 31.65,17.64 29.78,16.54 29.25,16.54 TB.2
(copper drawn outside any net)
  shapes: Bottom area x1